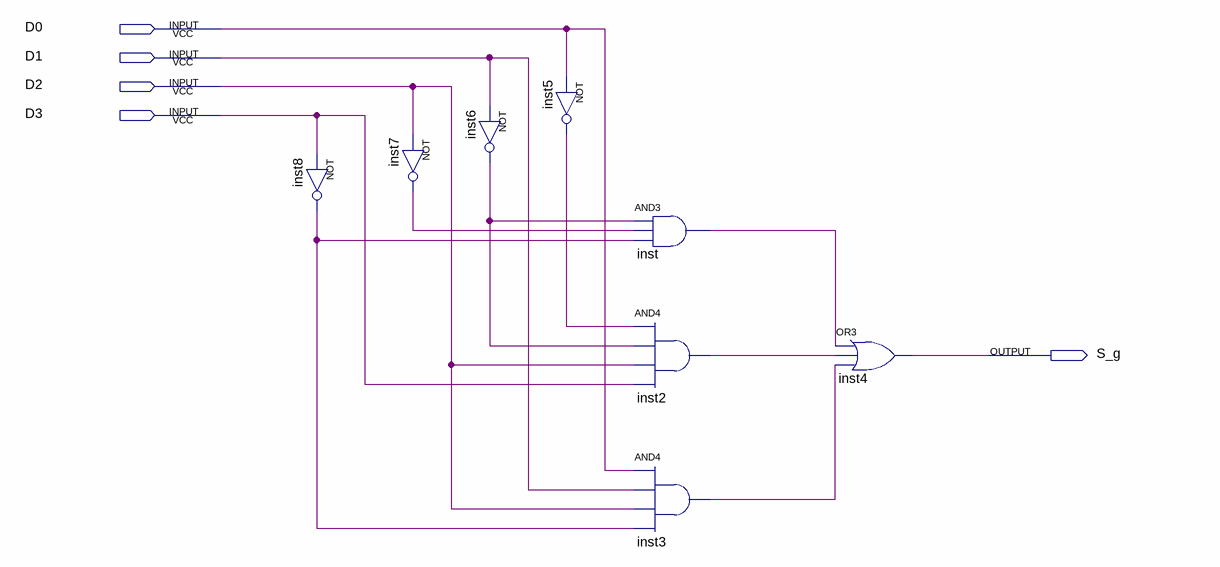
[diagram p0: schematic sheet]
// Quartus schematic S_g.bdf as structural Verilog: 8 symbols, 5 pins
module S_g (
  input  D0,
  input  D1,
  input  D2,
  input  D3,
  output S_g
);

  wire inst2_out, inst3_out, inst5_out, inst6_out, inst7_out, inst8_out, inst_out;

  not inst8 (inst8_out, D3);
  not inst7 (inst7_out, D2);
  not inst6 (inst6_out, D1);
  not inst5 (inst5_out, D0);
  and inst (inst_out, inst6_out, inst7_out, inst8_out);
  and inst2 (inst2_out, inst5_out, inst6_out, D2, D3);
  and inst3 (inst3_out, D0, D1, D2, inst8_out);
  or inst4 (S_g, inst_out, inst2_out, inst3_out);
endmodule
